# EAGLE board Environment2 (EAGLE 7.5.0)
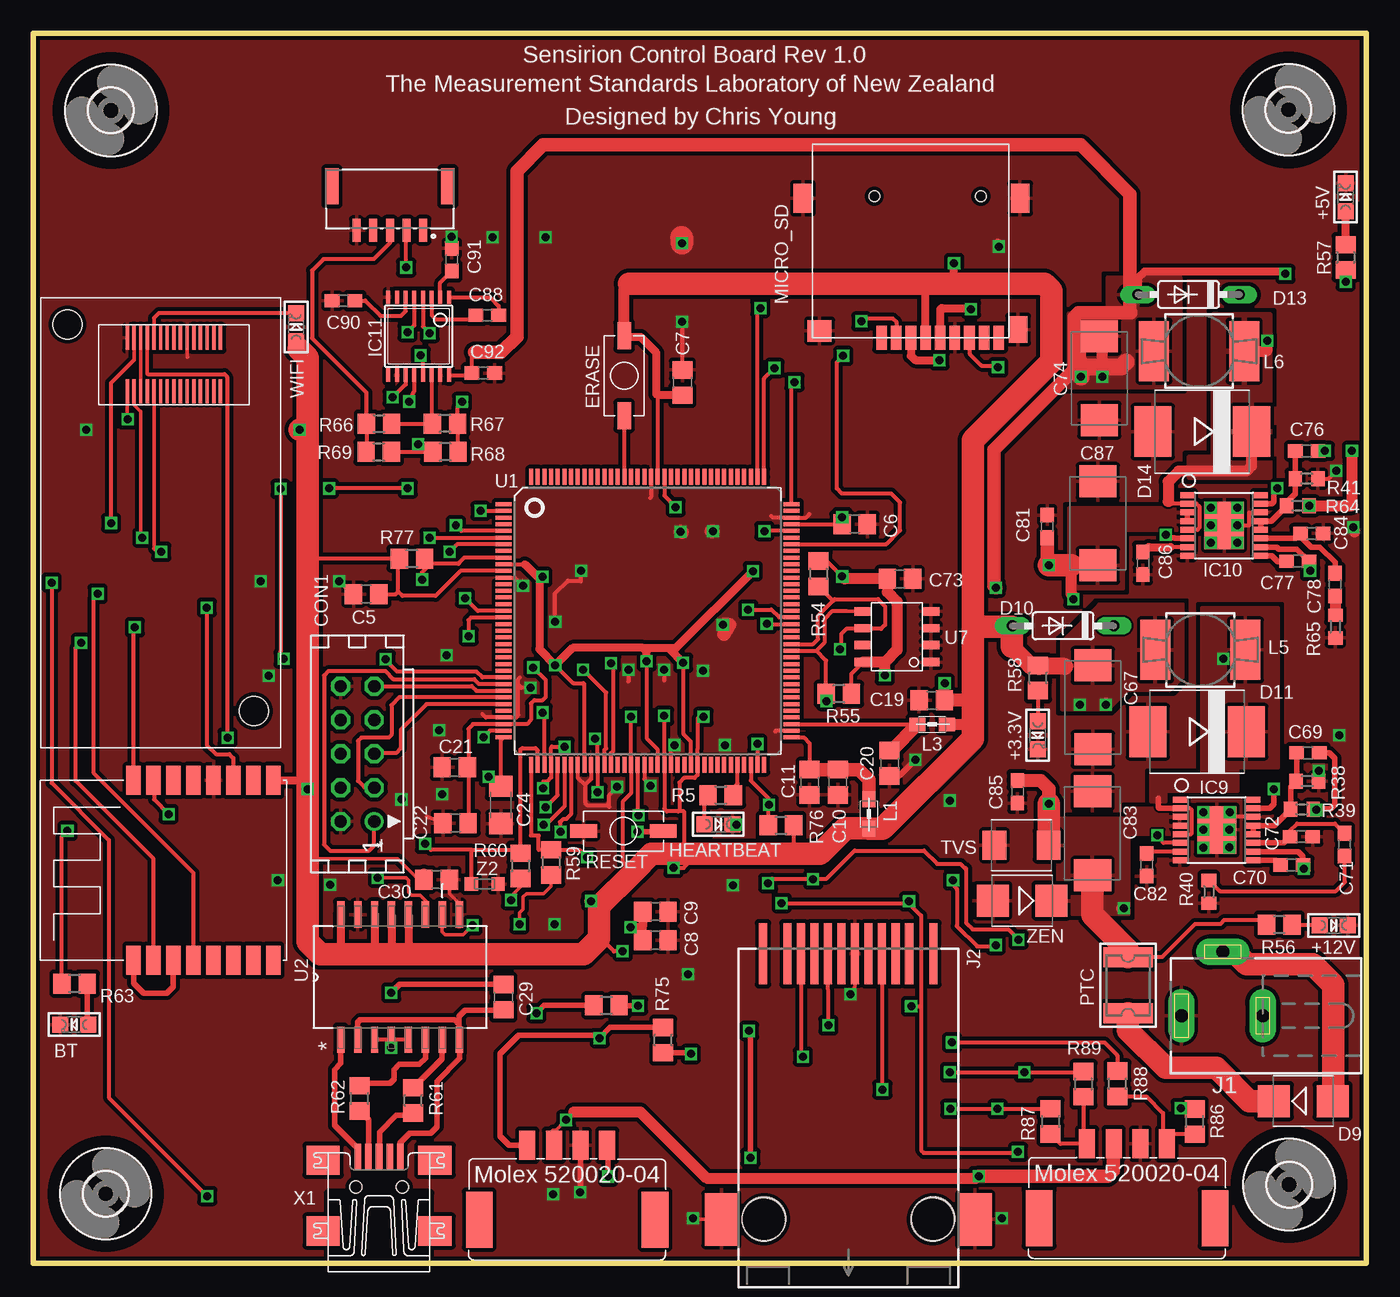
[diagram p8: board, top side]
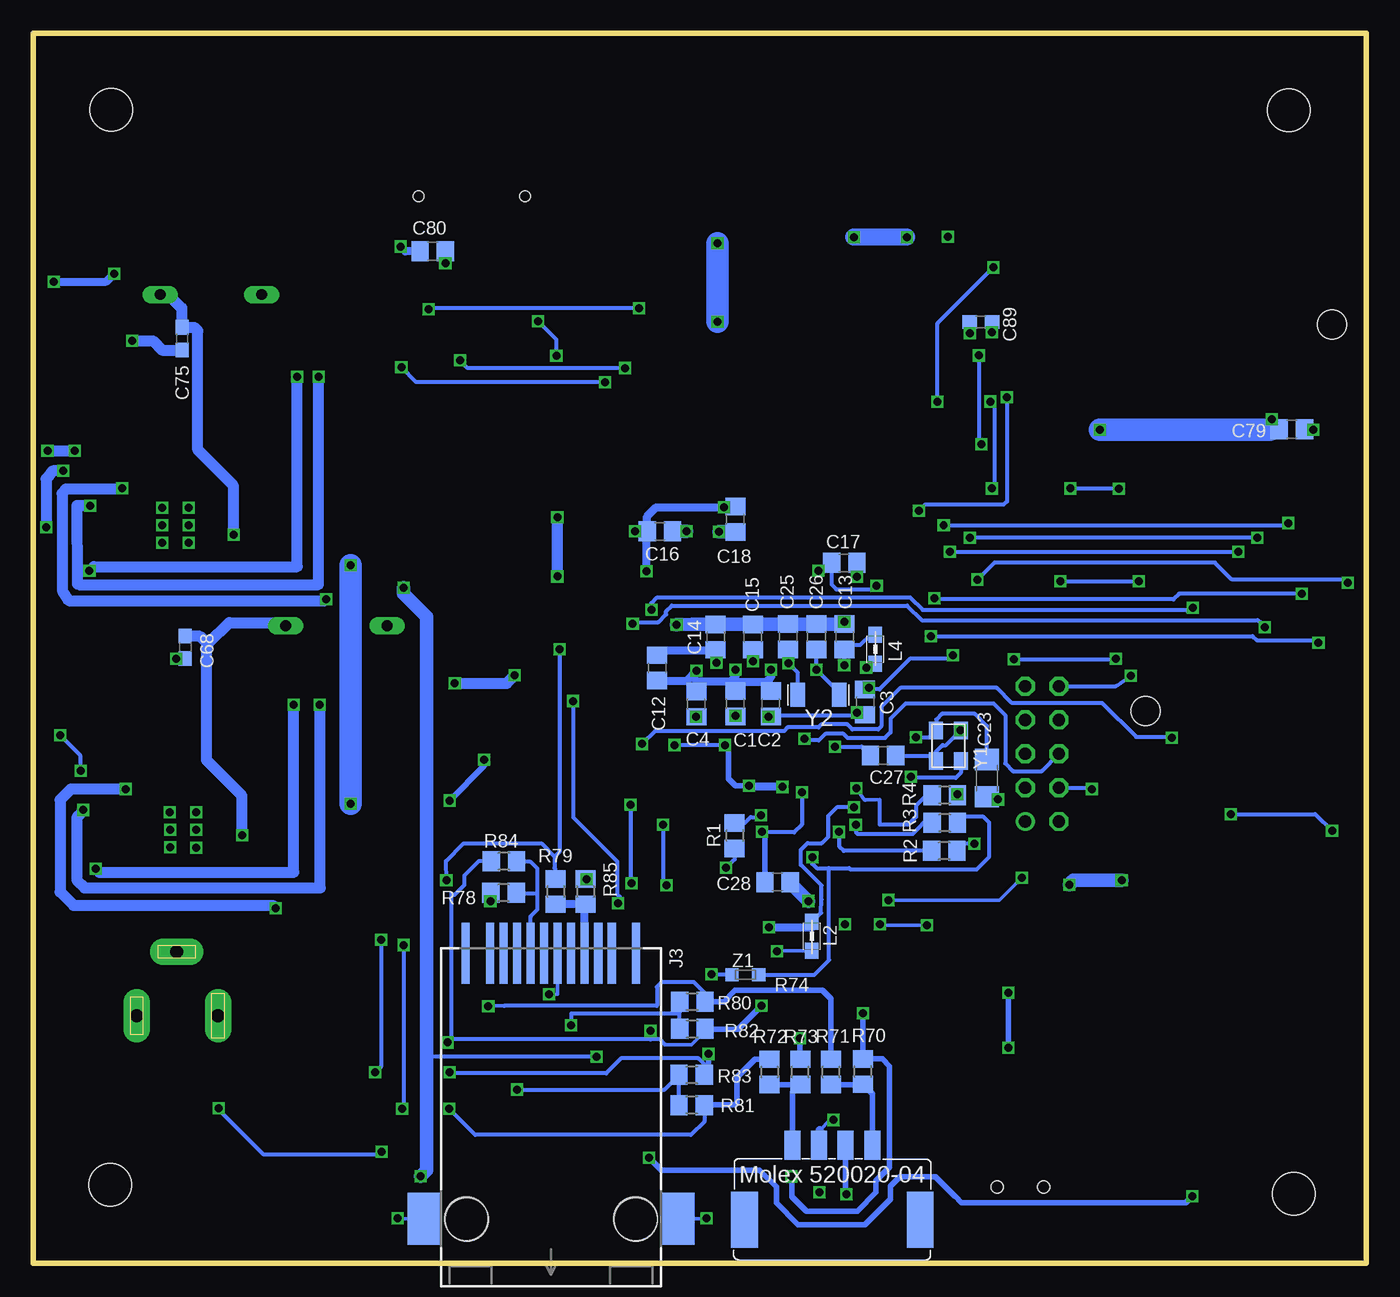
[diagram p9: board, bottom side, seen from below]

Size 100.08 x 92.33 mm. Coordinates in mm from the lower left corner, seen from the top.
Outline: 0,0 100.08,0 100.08,92.33 0,92.33 0,0
Copper layers (1*16): Top 0.035mm / dielectric 1.5mm / Bottom 0.035mm
Design rules "default": minimum track width 6mil, minimum drill 12mil, track to track 6mil, track to pad 6mil, pad to pad 6mil, via to via 6mil, smd to smd 0mil, copper to edge 10mil, drill to drill 10mil, minimum pad ring 10mil, minimum via ring 6mil, stop-mask expansion 2mil, vias tented up to drill 100mil, thermal gap 10mil
Net classes: 0 default: drill 0.305 mm, clearance 0.152 mm; 1 USB: drill 0.406 mm, clearance 0.152 mm to class 0, clearance 0.152 mm; 2 POWER_5V: width 0.61 mm, drill 0.305 mm, clearance 0.254 mm to class 0, clearance 0.254 mm to class 1, clearance 0.152 mm; 3 usbvcc: width 0.61 mm, drill 0.508 mm, clearance 0.152 mm to class 0, clearance 0.254 mm to class 1, clearance 0.254 mm to class 2, clearance 0.254 mm

## Footprints (pad centres in the part's own frame; a part is rotated, then mirrored left to right if it is on the bottom)
CHIPLED_0805 = smd 1.2 x 1.2: A 0,-1.05; C 0,1.05
C0805 = smd 1.3 x 1.5: 1 -0.95,0; 2 0.95,0
C1206 = smd 1.6 x 1.8: 1 -1.4,0; 2 1.4,0
SMC_D = smd 2.4 x 2.8: + -3.15,0; - 3.15,0
C0603 = smd 1.1 x 1: 1 -0.85,0; 2 0.85,0
CON10 = drill 0.914: 1 -5.08,-1.27 | drill 0.914 octagon: 2 -5.08,1.27; 3 -2.54,-1.27; 4 -2.54,1.27; 5 0,-1.27; 6 0,1.27; 7 2.54,-1.27; 8 2.54,1.27; 9 5.08,-1.27; 10 5.08,1.27
SMB = smd 2.4 x 2.4: A 2.2,0; C -2.2,0
DO35-7 = drill 0.813 long: A 3.81,0; C -3.81,0
SMC = smd 2.8 x 3.8: A 3.7,0; C -3.7,0
PUCHBUTTON = smd 2 x 1: P$1 3,0; P$2 -3,0
TSSOP16EXP = smd 0.45 x 1.05: 1 -2.275,-2.768; 2 -1.625,-2.768; 3 -0.975,-2.768; 4 -0.325,-2.768; 5 0.325,-2.768; 6 0.975,-2.768; 7 1.625,-2.768; 8 2.275,-2.768; 9 2.275,2.768; 10 1.625,2.768; 11 0.975,2.768; 12 0.325,2.768; 13 -0.325,2.768; 14 -0.975,2.768; 15 -1.625,2.768; 16 -2.275,2.768 | smd 3.58 x 2.94: EXP 0,0
TSSOP16 = smd 0.305 x 0.991: 1 -2.275,-2.918; 2 -1.625,-2.918; 3 -0.975,-2.918; 4 -0.325,-2.918; 5 0.325,-2.918; 6 0.975,-2.918; 7 1.625,-2.918; 8 2.275,-2.918; 9 2.275,2.918; 10 1.625,2.918; 11 0.975,2.918; 12 0.325,2.918; 13 -0.325,2.918; 14 -0.975,2.918; 15 -1.625,2.918; 16 -2.275,2.918
DCJ0303 = drill 1 pad 2 long: 1 0,3.1; 2 4.8,0; 3 0,-3
J30 = smd 0.61 x 4.597: 1 -6.401,-19.939; 2 -4.572,-19.939; 3 -3.556,-19.939; 4 -2.54,-19.939; 5 -1.524,-19.939; 6 -0.508,-19.939; 7 0.508,-19.939; 8 1.524,-19.939; 9 2.54,-19.939; 10 3.556,-19.939; 11 4.572,-19.939; 12 6.401,-19.939 | smd 2.489 x 3.912: S1 -9.525,0; S2 9.525,0 | hole 3.251: 6.35,0; -6.35,0
0805 = smd 1.2 x 1: 1 -1.1,0; 2 1.1,0
MS85 = smd 4.5 x 2.25: 1 0,-3.383; 2 0,3.383
MICROSD_PP = smd 1.8 x 0.8: 1 0,3.85; 2 0,2.75; 3 0,1.65; 4 0,0.55; 5 0,-0.55; 6 0,-1.65; 7 0,-2.75; 8 0,-3.85; 9 0,-4.95 | smd 1.6 x 1.8: GND@1 0.5,8.5 | smd 2.2 x 1.4: GND@2 10.45,9.75; GND@4 10.45,-6.55 | smd 2 x 1.4: GND@3 0.6,-6.4 | hole 0.8: 10.6,4.4; 10.6,-3.6
PTC1812 = smd 1.5 x 3.7: P$1 -2.1,0; P$2 2.1,0
R0805 = smd 1.3 x 1.5: 1 -0.95,0; 2 0.95,0
R0603 = smd 1 x 1.1: 1 -0.85,0; 2 0.85,0
SMBJ = smd 1.78 x 2.16: A 2.04,0; C -2.03,0
LQFP144 = smd 0.3 x 1.2: 1 -8.75,-10.8; 2 -8.25,-10.8; 3 -7.75,-10.8; 4 -7.25,-10.8; 5 -6.75,-10.8; 6 -6.25,-10.8; 7 -5.75,-10.8; 8 -5.25,-10.8; 9 -4.75,-10.8; 10 -4.25,-10.8; 11 -3.75,-10.8; 12 -3.25,-10.8; 13 -2.75,-10.8; 14 -2.25,-10.8; 15 -1.75,-10.8; 16 -1.25,-10.8; 17 -0.75,-10.8; 18 -0.25,-10.8; 19 0.25,-10.8; 20 0.75,-10.8; 21 1.25,-10.8; 22 1.75,-10.8; 23 2.25,-10.8; 24 2.75,-10.8; 25 3.25,-10.8; 26 3.75,-10.8; 27 4.25,-10.8; 28 4.75,-10.8; 29 5.25,-10.8; 30 5.75,-10.8; 31 6.25,-10.8; 32 6.75,-10.8; 33 7.25,-10.8; 34 7.75,-10.8; 35 8.25,-10.8; 36 8.75,-10.8; 73 8.75,10.8; 74 8.25,10.8; 75 7.75,10.8; 76 7.25,10.8; 77 6.75,10.8; 78 6.25,10.8; 79 5.75,10.8; 80 5.25,10.8; 81 4.75,10.8; 82 4.25,10.8; 83 3.75,10.8; 84 3.25,10.8; 85 2.75,10.8; 86 2.25,10.8; 87 1.75,10.8; 88 1.25,10.8; 89 0.75,10.8; 90 0.25,10.8; 91 -0.25,10.8; 92 -0.75,10.8; 93 -1.25,10.8; 94 -1.75,10.8; 95 -2.25,10.8; 96 -2.75,10.8; 97 -3.25,10.8; 98 -3.75,10.8; 99 -4.25,10.8; 100 -4.75,10.8; 101 -5.25,10.8; 102 -5.75,10.8; 103 -6.25,10.8; 104 -6.75,10.8; 105 -7.25,10.8; 106 -7.75,10.8; 107 -8.25,10.8; 108 -8.75,10.8 | smd 1.2 x 0.3: 37 10.8,-8.75; 38 10.8,-8.25; 39 10.8,-7.75; 40 10.8,-7.25; 41 10.8,-6.75; 42 10.8,-6.25; 43 10.8,-5.75; 44 10.8,-5.25; 45 10.8,-4.75; 46 10.8,-4.25; 47 10.8,-3.75; 48 10.8,-3.25; 49 10.8,-2.75; 50 10.8,-2.25; 51 10.8,-1.75; 52 10.8,-1.25; 53 10.8,-0.75; 54 10.8,-0.25; 55 10.8,0.25; 56 10.8,0.75; 57 10.8,1.25; 58 10.8,1.75; 59 10.8,2.25; 60 10.8,2.75; 61 10.8,3.25; 62 10.8,3.75; 63 10.8,4.25; 64 10.8,4.75; 65 10.8,5.25; 66 10.8,5.75; 67 10.8,6.25; 68 10.8,6.75; 69 10.8,7.25; 70 10.8,7.75; 71 10.8,8.25; 72 10.8,8.75; 109 -10.8,8.75; 110 -10.8,8.25; 111 -10.8,7.75; 112 -10.8,7.25; 113 -10.8,6.75; 114 -10.8,6.25; 115 -10.8,5.75; 116 -10.8,5.25; 117 -10.8,4.75; 118 -10.8,4.25; 119 -10.8,3.75; 120 -10.8,3.25; 121 -10.8,2.75; 122 -10.8,2.25; 123 -10.8,1.75; 124 -10.8,1.25; 125 -10.8,0.75; 126 -10.8,0.25; 127 -10.8,-0.25; 128 -10.8,-0.75; 129 -10.8,-1.25; 130 -10.8,-1.75; 131 -10.8,-2.25; 132 -10.8,-2.75; 133 -10.8,-3.25; 134 -10.8,-3.75; 135 -10.8,-4.25; 136 -10.8,-4.75; 137 -10.8,-5.25; 138 -10.8,-5.75; 139 -10.8,-6.25; 140 -10.8,-6.75; 141 -10.8,-7.25; 142 -10.8,-7.75; 143 -10.8,-8.25; 144 -10.8,-8.75
SOIC127P1032X265-16N = smd 1.981 x 0.559: 1 -4.699,4.445; 2 -4.699,3.175; 3 -4.699,1.905; 4 -4.699,0.635; 5 -4.699,-0.635; 6 -4.699,-1.905; 7 -4.699,-3.175; 8 -4.699,-4.445; 9 4.699,-4.445; 10 4.699,-3.175; 11 4.699,-1.905; 12 4.699,-0.635; 13 4.699,0.635; 14 4.699,1.905; 15 4.699,3.175; 16 4.699,4.445
CK_CUSTOM_SOIC8 = smd 0.635 x 1.27: PIN1 -1.905,-2.54; PIN2 -0.635,-2.54; PIN3 0.635,-2.54; PIN4 1.905,-2.54; PIN5 1.905,2.54; PIN6 0.635,2.54; PIN7 -0.635,2.54; PIN8 -1.905,2.54
560020-4 = smd 1.2 x 2.2: P$1 3,3.29; P$2 1,3.29; P$3 -1,3.29; P$4 -3,3.29 | smd 2 x 4.2: P$A -6.6,-2.29; P$B 6.6,-2.29
NANOREACH = smd 1.8 x 0.25: P1 7,6.5; P2 3,6.5; P3 7,7; P4 3,7; P5 7,7.5; P6 3,7.5; P7 7,8; P8 3,8; P9 7,8.5; P10 3,8.5; P11 7,9; P12 3,9; P13 7,9.5; P14 3,9.5; P15 7,10; P16 3,10; P17 7,10.5; P18 3,10.5; P19 7,11; P20 3,11; P21 7,11.5; P22 3,11.5; P23 7,12; P24 3,12; P25 7,12.5; P26 3,12.5; P27 7,13; P28 3,13; P29 7,13.5; P30 3,13.5 | hole 2.2: 2,2; 31,16
3,2 = hole 3.2: 0,0
HM-13 = smd 2.184 x 1.067: P$1 0,11.5; P$2 0,10; P$3 0,8.5; P$4 0,7; P$5 0,5.5; P$6 0,4; P$7 0,2.5; P$8 0,1; P$9 13.5,1; P$10 13.5,2.5; P$11 13.5,4; P$12 13.5,5.5; P$13 13.5,7; P$14 13.5,8.5; P$15 13.5,10; P$16 13.5,11.5
UX60-MB-5ST = smd 2 x 0.5: 1 2.25,1.6; 2 2.25,0.8; 3 2.25,0; 4 2.25,-0.8; 5 2.25,-1.6 | smd 2.2 x 2.5: M1 -3.3,-4.2; M2 -3.3,4.2; M3 2,4.2; M4 2,-4.2 | hole 0.9: 0,-1.75; 0,1.75
CM-502386-05 = smd 0.6 x 1.7: 1 2.5,-4.55; 2 1.25,-4.55; 3 0,-4.55; 4 -1.25,-4.55; 5 -2.5,-4.55 | smd 1 x 2.7: P1 4.35,-1.25; P2 -4.35,-1.25
CRYSTAL-3.2-2.5 = smd 1.3 x 1.05: 1 -1.15,-0.925; 2 1.15,-0.925; 3 1.15,0.925; 4 -1.15,0.925
ARDUINO_WIFI_SHIELD_V018_TG_RESONATOR_EPSON_FC_145 = smd 1.1 x 1.8: P$1 -1.55,0; P$2 1.55,0
CT/CN0603 = smd 1 x 1: 1 -1,0; 2 1,0

## Placement (x,y rotation side)
+3.3V  [CHIPLED_0805]  75.41,39.65 180 top
+5V  [CHIPLED_0805]  98.53,80.04 0 top
+12V  [CHIPLED_0805]  97.64,25.37 270 top
BT  [CHIPLED_0805]  3.07,17.93 90 top
C1  10u  [C0805]  47.37,42.01 90 bottom
C2  0.1u  [C0805]  44.7,42.01 90 bottom
C3  0.1u  [C0805]  37.62,42.14 90 bottom
C4  0.1u  [C0805]  50.29,41.99 90 bottom
C5  0.1u  [C0805]  24.99,50.24 180 top
C6  0.1u  [C0805]  61.67,55.5 0 top
C7  0.1u  [C0805]  48.74,66.12 90 top
C8  0.1u  [C0805]  46.71,24.26 0 top
C9  10u  [C0805]  46.71,26.42 0 top
C10  0.1u  [C0805]  60.4,36.12 270 top
C11  10u  [C0805]  58.29,36.12 270 top
C12  10u  [C0805]  53.24,44.7 270 bottom
C13  0.1u  [C0805]  39.17,47.04 90 bottom
C14  0.1u  [C0805]  48.84,47.02 90 bottom
C15  0.1u  [C0805]  46.05,47.02 90 bottom
C16  0.1u  [C0805]  53.04,54.94 0 bottom
C17  0.1u  [C0805]  39.19,52.58 180 bottom
C18  0.1u  [C0805]  47.37,55.85 270 bottom
C19  0.1u  [C0805]  67.46,42.27 180 top
C20  0.1u  [C0805]  64.29,37.54 270 top
C21  0.1u  [C0805]  31.65,37.24 180 top
C22  10u  [C0805]  31.7,33.05 180 top
C23  22p  [C1206]  28.47,36.42 270 bottom
C24  22p  [C1206]  35.1,34.42 270 top
C25  22p  [C0805]  43.41,47.04 90 bottom
C26  22p  [C0805]  41.27,47.04 90 bottom
C27  22p  [C0805]  36.27,38.13 0 bottom
C28  0.01u  [C0805]  44.2,28.63 180 bottom
C29  0.1uF  [C0805]  35.31,19.99 270 top
C30  0.1uF  [C0805]  30.28,28.8 0 top
C67  10uF  [SMC_D]  79.55,41.73 270 top
C68  0.68uF  [C0603]  88.67,46.25 270 bottom
C69  27pF  [C0603]  95.71,38.33 180 top
C70  0.1uF  [C0603]  94.49,29.9 0 top
C71  4700pF  [C0603]  98.45,31.45 270 top
C72  470pF  [C0603]  95.2,32.03 0 top
C73  0.1u  [C0805]  65.07,51.38 0 top
C74  10uF  [SMC_D]  80.04,66.45 270 top
C75  0.68uF  [C0603]  88.9,69.42 270 bottom
C76  27pF  [C0603]  95.61,60.99 180 top
C77  0.1uF  [C0603]  94.95,52.7 0 top
C78  4700pF  [C0603]  97.74,50.95 270 top
C79  10u  [C0805]  5.59,62.61 0 bottom
C80  0.1uF  [C0805]  70.08,75.97 180 bottom
C81  0.1uF  [C0603]  76.12,55.32 90 top
C82  1uF  [C0603]  83.59,29.92 270 top
C83  10uF  [SMC_D]  79.53,32.28 90 top
C84  470pF  [C0603]  95.99,54.79 0 top
C85  0.1uF  [C0603]  73.89,35.41 270 top
C86  1uF  [C0603]  83.31,52.55 270 top
C87  10uF  [SMC_D]  79.93,55.55 90 top
C88  0.1uF  [C0603]  34.09,71.17 180 top
C89  0.1uF  [C0603]  28.93,70.66 0 bottom
C90  0.1uF  [C0603]  23.29,72.26 180 top
C91  0.1uF  [C0603]  31.42,75.34 90 top
C92  0.1uF  [C0603]  33.78,66.83 0 top
CON1  [CON10]  24.33,38.25 90 top
D9  B360B-13-F  [SMB]  95.35,12.19 0 top
D10  1N4148DO35-7  [DO35-7]  77.32,47.85 180 top
D11  MBRS340T3  [SMC]  87.38,39.9 180 top
D13  1N4148DO35-7  [DO35-7]  86.74,72.72 180 top
D14  MBRS340T3  [SMC]  87.76,62.43 180 top
ERASE  PUCHBUTTON  [PUCHBUTTON]  44.36,66.63 270 top
HEARTBEAT  [CHIPLED_0805]  51.44,32.97 270 top
IC9  LT3434  [TSSOP16EXP]  88.85,32.54 270 top
IC10  LT3434  [TSSOP16EXP]  89.41,55.4 270 top
IC11  MAX3232CUE  [TSSOP16]  28.93,69.6 180 top
J1  [DCJ0303]  89.31,18.59 90 top
J2  J3011  [J30]  61.19,3.3 180 top
J3  J3011  [J30]  61.21,3.35 180 bottom
L1  MH2029-300Y  [0805]  62.74,33.73 90 top
L2  MH2029-300Y  [0805]  41.63,24.56 90 bottom
L3  MH2029-300Y  [0805]  67.49,40.46 180 top
L4  MH2029-300Y  [0805]  36.86,46.1 270 bottom
L5  33uH  [MS85]  87.63,46.05 90 top
L6  33uH  [MS85]  87.53,68.48 90 top
MICRO_SD  MICRO_SD  [MICROSD_PP]  67.54,69.49 90 top
PTC  [PTC1812]  82.19,20.88 270 top
R1  100k  [R0805]  47.42,32.11 270 bottom
R2  39R 1%  [R0805]  31.67,30.96 180 bottom
R3  39R 1%  [R0805]  31.65,33.07 180 bottom
R4  6k8 1%  [R0805]  31.65,35.15 180 bottom
R5  402R  [R0805]  51.61,35.15 0 top
R38  100K  [R0603]  95.66,36.2 180 top
R39  300K  [R0603]  95.25,34.09 180 top
R40  10K  [R0603]  88.27,27.89 90 top
R41  100K  [R0603]  95.61,58.9 180 top
R54  4.7k  [R0805]  58.95,51.76 270 top
R55  4.7k  [R0805]  60.48,42.75 180 top
R56  3k3  [R0805]  93.55,25.43 180 top
R57  1k  [R0805]  98.53,75.51 270 top
R58  402R  [R0805]  75.44,43.94 90 top
R59  24R  [R0805]  38.89,30.1 270 top
R60  24R  [R0805]  36.58,29.84 270 top
R61  24R  [R0805]  28.52,12.24 90 top
R62  24R  [R0805]  24.49,12.4 90 top
R63  402R  [R0805]  3.1,21.01 180 top
R64  165K  [R0603]  94.95,56.87 180 top
R65  10K  [R0603]  97.76,47.8 90 top
R66  0R  [R0805]  25.96,63.04 0 top
R67  DNF  [R0805]  30.91,63.04 180 top
R68  0R  [R0805]  30.94,60.91 180 top
R69  DNF  [R0805]  25.93,60.91 0 top
R70  DNF  [R0805]  37.8,14.4 90 bottom
R71  0R  [R0805]  40.18,14.38 90 bottom
R72  0R  [R0805]  44.81,14.38 270 bottom
R73  DNF  [R0805]  42.49,14.38 90 bottom
R74  DNF  [R0805]  43.03,19.38 0 top
R75  DNF  [R0805]  47.29,16.76 90 top
R76  DNF  [R0805]  56.13,32.89 0 top
R77  DNF  [R0805]  28.42,52.91 180 top
R78  0R  [R0805]  64.77,27.81 180 bottom
R79  0R  [R0805]  60.86,27.91 270 bottom
R80  0R  [R0805]  50.6,19.66 0 bottom
R81  0R  [R0805]  50.65,11.89 180 bottom
R82  DNF  [R0805]  50.6,17.6 0 bottom
R83  DNF  [R0805]  50.65,14.15 180 bottom
R84  DNF  [R0805]  64.74,30.18 180 bottom
R85  DNF  [R0805]  58.62,27.91 270 bottom
R86  0R  [R0805]  87.2,10.64 90 top
R87  0R  [R0805]  76.38,10.67 270 top
R88  DNF  [R0805]  81.41,13.49 90 top
R89  DNF  [R0805]  78.84,13.46 270 top
RESET  PUCHBUTTON  [PUCHBUTTON]  44.31,32.45 180 top
TVS  SMBJ15A-TR  [SMBJ]  74.19,31.39 180 top
U1  ATSAM3X8EA-AU  [LQFP144]  46.13,48.23 270 top
U2  ADUM4160BRWZ  [SOIC127P1032X265-16N]  27.53,21.49 90 top
U7  CK_CUSTOM_M24M02-DRMN6TP  [CK_CUSTOM_SOIC8]  64.85,47.04 90 top
U8  560020-04  [560020-4]  82.12,5.69 0 top
U9  560020-04  [560020-4]  40.08,5.59 0 top
U10  560020-04  [560020-4]  40.08,5.59 0 bottom
U$1  NANOREACH  [NANOREACH]  0.56,72.47 270 top
U$2  [3,2]  94.28,5.92 0 top
U$3  HM-13  [HM-13]  19.02,22.76 90 top
U$4  [3,2]  5.82,86.54 0 top
U$5  [3,2]  94.23,86.59 0 top
U$6  [3,2]  5.44,5.23 0 top
WIFI  [CHIPLED_0805]  19.74,70.28 0 top
X1  MINI-USB-UX60-MB-5ST  [UX60-MB-5ST]  25.96,5.74 90 top
X2  [CM-502386-05]  26.77,82.09 0 top
Y1  12MHz KX-7 20pF  [CRYSTAL-3.2-2.5]  31.37,38.86 90 bottom
Y2  32.768Khz  [ARDUINO_WIFI_SHIELD_V018_TG_RESONATOR_EPSON_FC_145]  41.12,42.67 0 bottom
Z1  CG0603MLC-05E  [CT/CN0603]  46.62,21.67 180 bottom
Z2  CG0603MLC-05E  [CT/CN0603]  33.89,28.47 0 top
ZEN  1SMB5929BT3G  [SMB]  74.24,27.23 180 top

## Tracks (layer width: path | path; a pad name or v marks a point on that pad's centre or on a via)
+3V3  (via drill 0.6)
  Top 0.254: C30.1 28.93,28.8 27.36,30.38 20.75,30.38 20.6,30.23 | v7.09,63.35 7.06,63.35 U$1.P1
  Top 0.305: 20.6,52.58 20.93,52.91 R77.2 27.41,52.84 27.41,50.42 | 55.74,30.88 55.88,30.73 | v48.06,29.69 48.82,29.69 49.15,30.02 49.15,30.73 48.84,31.04 48.84,33.93 48.44,33.93 | v44.88,41.05 44.88,39.83 U1.52 44.88,35.27 44.25,34.65 44.25,30.15 45.05,29.35 | 47.38,40.16 v47.37,41.1 U1.57 47.38,34.13 47.57,33.93 48.44,33.93 | v50.32,41.02 49.89,40.92 49.88,38.64 U1.62 49.88,36.67 49.66,36.45 48.87,36.45 48.51,36.09 48.51,34.01 48.44,33.93 | 49.88,30.8 49.81,30.73 | v44.25,23.42 43.59,23.42 42.49,24.51 | 46.87,65.17 46.88,65.16 U1.125 | U1.105 60.71,55.48 C6.1 | R76.2 57.08,31.13 57.48,30.73 | R55.1 61.43,44.26 U7.PIN8 | R54.1 59.58,52.71 v60.73,51.56 | U1.11 32.07,51.98 30.2,50.11 27.71,50.11 27.41,50.42 | C5.1 27.23,50.24 27.41,50.42 | U1.39 38.38,41.23 v38.25,41.35 | 95,30.91 95.35,30.56 95.35,29.69 v95.4,29.64
  Top 0.406: WIFI.A 19.74,68.86 19.94,68.66 | IC9.10 94.79,30.91 | 94.79,30.91 | 94.79,30.91 95,30.91 95.33,30.58 95.33,29.91 C70.2 | R39.1 96.29,34.09 v96.34,34.04 96.42,34.11 97.41,34.11 97.71,34.42 97.71,37.92 97.31,38.33 C69.1 | 77.5,44.88 77.42,44.81
  Top 0.61: 69.12,73.52 69.12,75.07 v69.14,75.08 | MICRO_SD.4 66.99,73.47 66.93,73.53 | C7.1 46.87,65.17 46.79,65.25 46.79,68.35 45.62,69.52 44.47,69.52 ERASE.P$2 | U$3.P$9 20.54,36.26 20.6,36.2 | 68.56,40.43 L3.1 | U2.16 23.09,23.29 23.19,23.19 | U2.14 25.63,23.24 25.58,23.19 | U2.13 26.9,23.32 26.77,23.19 | U2.12 28.17,23.22 28.14,23.19
  Top 0.813: 29.31,29.25 C30.1 | 69.12,73.52 69.11,73.53 | ERASE.P$2 44.36,73.17 44.73,73.53 | L3.1 70.36,40.46 70.54,40.28 | 63.93,45.14 64.85,46.05 64.85,49.68 64.12,50.4 C73.1 60.91,51.38 v60.73,51.56 | 63.93,45.14 U7.PIN8 | v60.73,56.01 60.73,55.51 C6.1 | C19.1 68.41,43.52 v68.43,43.54 | v63.93,44.15 63.93,45.14 | v80.52,41.94 80.52,42.04 80.54,42.06 | v78.56,41.94 78.56,41.91 | R58.2 74.84,44.89 | D10.A 73.46,47.8
  Top 1.016: v41.88,27.2 42.09,27.2 42.49,26.8 | C19.1 70.56,42.32 70.54,42.52
  Top 1.27: 74.84,44.89 73.46,46.28 | 77.42,44.81 75.52,44.81 R58.2
  Top 1.676: 20.6,62.56 20.6,52.58 20.6,36.2 v20.6,35.61 20.6,30.23 20.6,24.13 21.54,23.19 23.19,23.19 25.58,23.19 26.77,23.19 28.14,23.19 41.33,23.19 42.49,24.36 42.49,24.51 42.49,26.8 45.05,29.35 46.43,30.73 49.15,30.73 49.81,30.73 55.88,30.73 57.48,30.73 59.05,30.73 60.98,32.66 62.7,32.66 L1.1 63.77,32.63 70.54,39.4 70.54,40.28 70.54,42.52 70.54,47.88 | 20.6,62.56 20.6,68 19.94,68.66 | v19.99,62.56 20.6,62.56 | 44.73,73.53 66.93,73.53 69.11,73.53 75.92,73.53 76.43,73.03 76.43,67.67 70.54,61.77 70.54,47.88 | 70.54,47.88 70.61,47.8 73.46,47.8 73.46,46.28
  Bottom 0.305: v7.09,63.35 7.09,62.71 7.24,62.56 | R1.2 47.42,30.33 v48.06,29.69 | v44.88,41.05 44.69,41.05 C2.1 44.64,41.12 38.4,41.12 | v47.37,41.1 47.39,41.05 C1.1 | v38.25,41.35 38.4,41.12 | 38.4,41.12 C3.1 | v50.32,41.02 50.28,41.01 C4.1 | L2.1 44.23,23.44 v44.25,23.42 | CON1.4 20.7,35.71 v20.6,35.61
  Bottom 0.406: C79.1 6.54,62.8 v7.09,63.35
  Bottom 0.61: v69.14,75.08 C80.1
  Bottom 0.813: v60.73,51.56 v60.73,56.01 | v68.43,43.54 64.54,43.54 v63.93,44.15 | v95.4,29.64 95.38,29.64 95.1,29.36 80.54,29.36 80.52,29.39 v80.52,41.94 | v96.34,34.04 96.34,33.96 96.52,33.78 96.52,33.76 96.8,33.48 96.8,28.78 96.22,28.19 78.54,28.19 78.54,41.76 v78.56,41.94
  Bottom 1.016: C28.1 43.25,28.57 v41.88,27.2
  Bottom 1.676: 7.24,62.56 v19.99,62.56
  pour Top: 86.31,44.02 86.31,49.45 80.04,49.45 77.22,46.63 77.22,41.61 80.72,41.61 82.19,43.08 85.37,43.08
+5V  (via drill 0.6)
  Top 0.254: 39.08,9.85 v40.01,10.77
  Top 0.305: IC11.16 32.78,66.68 C92.1 32.93,68.16 33.15,68.38 | J2.10 57.63,15.67 v57.78,15.52 | v40.01,10.77 40.01,10.82 40.56,11.38
  Top 0.406: IC10.10 93.37,53.77 93.52,53.62 94.88,53.62 | 94.88,53.62 C77.2 | 94.88,53.62 94.88,53.61 95.86,52.63 v95.86,51.99
  Top 0.61: R57.2 v98.53,73.69 | v94,74.27 93.9,74.27 93.73,74.45 83.44,74.45 82.93,73.94 D13.A | U9.P$3 39.08,9.85
  Top 0.813: v80.26,66.55 80.26,69.37 C74.+ | v95.81,56.87 R64.1 99.03,56.87 | v78.66,66.55 78.66,69.42 78.84,69.6 C74.+ | C74.+ | 99.06,56.9 99.03,56.87 | 99.03,56.87 99.03,61.01 v99.01,60.98 | v96.98,60.98 C76.1 | 40.56,11.38 45.57,11.38 50.55,6.4 70.84,6.4 v70.99,6.55
  Top 1.016: 33.15,68.38 35.13,68.38 36.32,69.57 36.32,81.99 38.28,83.95 78.64,83.95 82.35,80.24 82.35,73.3 | 82.35,73.3 D13.A | 82.35,73.3 82.35,71.42 82.42,71.35 78.46,71.35 78.18,71.07 78.18,67.13 72.14,61.09 72.14,50.85 v72.26,50.72 | v70.99,6.55 80.67,6.55 81.08,6.96 81.08,8.94 U8.P$3
  Top 1.27: v78.66,66.55 78.66,67.51 78.31,67.87 78.31,67.54 78.56,67.28 81.66,67.28 82.04,67.67
  Bottom 0.254: v40.01,10.77 40.26,10.77 41.02,10.01
  Bottom 0.305: v57.78,15.52 70.26,15.52 70.54,15.24
  Bottom 0.61: v98.53,73.69 94.59,73.69 v94,74.27 | 41.02,10.01 41.02,8.94 U10.P$3
  Bottom 0.813: v95.86,51.99 95.81,51.99 95.5,52.3 80.26,52.3 v80.26,66.55 | v95.81,56.87 96.8,56.87 96.77,51 96.65,50.95 78.66,50.95 v78.66,66.55 | v99.01,60.98 v96.98,60.98
  Bottom 1.016: v72.26,50.72 72.26,50.27 70.54,48.54 70.54,15.24 70.54,7.01 v70.99,6.55
  pour Top: 77.72,65.71 86.16,65.71 86.16,74.02 80.64,74.02 80.64,71.32 77.72,71.32
+12V  (via drill 0.6)
  Top 0.305: PTC.P$1 82.2,22.99 84.73,22.99 87.22,25.48 89.13,25.48 89.43,25.78 92.24,25.78 R56.2
  Top 0.406: IC10.15 92.99,57.02 93.14,57.17 93.14,57.94 v93.4,58.19 | IC9.15 92.84,34.16 93.14,34.47 v93.14,35.61 | IC10.3 IC10.4
  Top 0.813: v78.08,49.86 78.08,50.09 77.93,50.24 77.93,52.4 C87.+ | v81.86,26.64 81.71,26.64
  Top 1.016: C81.1 76.12,52.53 v76.25,52.4 | C85.1 75.64,36.25 76.25,35.64 v76.25,34.52
  Top 1.676: PTC.P$1 82.19,23.5 79.53,26.16 C83.+ | 77.93,52.4 v76.25,52.4 | v76.25,34.52 76.25,31.42 TVS.C
  Bottom 0.813: v93.4,58.19 93.4,58.22 93.45,58.12 97.64,58.12 97.92,57.78 97.89,50.52 97.41,49.76 78.18,49.76 v78.08,49.86 | v93.14,35.61 97.26,35.61 98.07,34.8 98.07,27.89 97.05,26.87 82.09,26.87 v81.86,26.64
  Bottom 1.676: v76.25,52.4 v76.25,34.52
  pour Top: 86.08,34.09 86.97,34.09 86.97,32.23 82.22,32.23 82.22,26.21 76.96,26.21 76.96,33.43 82.17,33.43 82.17,34.16 86.08,34.16
  pour Top: 87.22,55.47 87.22,56.67 77.75,56.67 77.75,50.67 81.84,50.67 81.84,54.66 81.84,54.94 81.84,55.02 81.84,55.07 87.33,55.07
A  (via drill 0.6)
  Top 0.406: R74.1 38.35,19.38 v37.77,18.8 | v43.16,6.53 43.16,8.8 U9.P$1
  Bottom 0.406: v37.77,18.8 37.77,15.38 R70.2 36.33,15.35 35.79,14.81 35.79,7.24 36.8,6.22 36.8,5.33 38.2,3.94 42.04,3.94 43.1,5 43.1,6.48 v43.16,6.53
AVREF
  Top 0.305: U1.75 66.36,40.48 L3.2
  Top 1.016: C20.1 64.42,38.49 L3.2
B  (via drill 0.6)
  Top 0.406: U9.P$4 37.07,8.87 35.71,8.87 35.04,9.54 35.04,15.73 36.45,17.14 42.29,17.14 v42.52,16.92 43.32,17.71 R75.2
  Bottom 0.406: v42.52,16.92 42.52,15.35 R73.2
D10  (via drill 0.6)
  Top 0.305: U1.102 64.04,53.98 65.08,55.02 65.08,57.12 64.41,57.78 60.71,57.78 60.33,58.17 60.33,67.64 v60.81,68.12 | v62.18,70.71 62.33,70.71 62.56,70.94 64.52,70.94 64.8,70.66 64.8,69.5 MICRO_SD.2
  Bottom 0.305: v60.81,68.12 60.81,69.34 v62.18,70.71
D13
  Top 0.305: R5.2 52.56,35.7 52.88,36.02 U1.68
D18  (via drill 0.6)
  Top 0.254: U$1.P9 9.06,53.68 9.12,53.62
  Top 0.305: U1.7 31.84,53.98 v31.27,53.42 | v9.6,53.42 9.32,53.42 9.12,53.62 9.07,53.67
  Bottom 0.305: v31.27,53.42 v9.6,53.42
D42  (via drill 0.6)
  Top 0.254: 8.56,66.78 U$1.P8
  Top 0.305: 8.56,66.78 8.59,66.75 14.35,66.75 14.55,66.55 14.55,39.5 v14.58,39.47 | v54.36,38.99 54.36,37.45 U1.71
  Bottom 0.305: v54.36,38.99 53.39,39.95 43.71,39.95 43.43,40.23 41.12,40.23 40.89,40.46 38.96,40.46 38.58,40.08 36.63,40.08 36.4,40.31 36.4,41.78 34.98,43.2 27.74,43.2 26.59,42.06 19.81,42.06 17.27,39.52 14.63,39.52 v14.58,39.47
D64  (via drill 0.6)
  Top 0.305: U$3.P$16 7.53,47.66 v7.62,47.75 | v55.07,48.01 55.09,47.98 U1.90
  Bottom 0.305: 7.95,48.13 7.62,47.8 v7.62,47.75 8.15,48.28 33.38,48.28 34.47,49.38 52.12,49.38 52.55,48.95 52.55,48.72 53.14,48.13 54.94,48.13 v55.07,48.01
D65  (via drill 0.6)
  Top 0.305: U1.91 56.01,48.48 55.42,49.07 v53.67,49.07 | v13.03,49.23 13.03,38.91 13.72,38.23 14.71,38.23 15.01,37.92 15.01,36.27 U$3.P$11
  Bottom 0.305: 13.36,48.9 v13.03,49.23 | 13.18,49.07 v13.03,49.23 | v53.67,49.07 53.67,49.55 53.24,49.99 34.24,49.99 33.3,49.05 13.21,49.05 v13.03,49.23
D+  (via drill 0.6)
  Top 0.305: v41.58,30.48 41.01,31.05 R59.1 37.94,31.05 37.95,31.11 37.95,32.11 37.54,32.11 | 37.54,32.11 37.36,32.11 37.38,32.12 | U1.37 37.38,32.27 37.54,32.11
  Bottom 0.305: v41.58,30.48 41.58,30 41.25,29.67 40.36,29.67 | 40.36,29.67 38.81,29.67 38.71,29.57 29.26,29.57 28.3,30.53 28.3,33.1 28.73,33.53 30.7,33.53 R3.1 | Z1.1 41.43,21.67 40.34,22.76 40.34,29.64 40.36,29.67
D-  (via drill 0.6)
  Top 0.305: 32.94,31.05 29.86,31.05 v29.41,31.5 | Z2.1 32.89,31 32.94,31.05 | 32.94,31.05 36.32,31.05 R60.1 36.58,38.56 36.7,38.68 37.69,38.68 37.88,38.5 U1.38
  Bottom 0.305: v29.41,31.5 30.7,31.5 R2.1
ERASE_S
  Top 0.305: U1.130 44.38,63.62 ERASE.P$1
IGND  (via drill 0.6)
  Top 0.254: U2.9 31.98,26.26 31.85,26.39 31.85,27.15 31.24,27.76 31.24,28.79 C30.2 | J2.6 61.7,20.8 v61.34,20.19 | v72.72,3.38 72.9,3.38 72.92,3.4 | J2.S2 49.61,3.3 v49.53,3.38 | 11.56,68.05 U$1.P20
  Top 0.305: IC10.EXP v90.4,55.4 91.24,55.4 91.26,55.42 91.26,55.4 91.29,55.37 91.29,56.36 92.17,56.36 IC10.14 | v17.68,44.09 17.65,44.35 17.63,44.37 | v47.37,44.55 47.37,43.74 | v44.7,44.55 44.68,43.66 | v50.27,44.5 50.27,44.53 | C22.2 29.54,33.53 | v31.04,45.64 30.96,45.64 30.94,45.67 | 36.73,51.16 36.73,51.21 36.75,51.18 v36.75,50.88 36.15,51.48 U1.12 | v39.19,48.16 39.19,50.31 40.14,51.26 41.05,51.26 41.12,51.18 v41.12,51.99 | v30.45,40.01 30.43,39.98 | C91.2 v31.42,77.06 | HEARTBEAT.C 52.48,32.94 52.65,32.77 52.65,32.79 v52.81,32.94 | v52.53,28.4 52.38,28.4 | v49.15,21.69 49.3,21.69 | U1.58 47.88,38.63 v48.16,38.91 | v51.92,38.91 52.05,38.91 | U1.54 45.88,36.34 v46.35,35.87 | U1.46 41.88,36.37 41.43,35.92 | 41.43,35.92 41.43,34.54 41.58,34.39 43.1,34.39 43.23,34.27 43.23,35.15 v43.84,35.76 | v27.64,34.82 27.51,34.82 | C7.2 48.74,70.66 v48.72,70.69 | R38.1 96.51,36.97 v96.52,36.98 | v98.07,39.65 98.27,39.65 | U1.44 40.88,36.47 41.43,35.92 | U1.126 46.38,57.5 46.33,57.45 | U1.74 55.76,39.98 55.7,39.93 55.73,39.93 55.75,39.95 | 39.12,25.5 v39.14,25.48 | 33.73,41.22 33.97,40.98 U1.33 36.26,40.98 36.32,41.05 36.32,41.07 36.35,41.1 36.35,41.12 36.4,41.17 36.4,43.46 | 36.4,43.46 36.4,43.84 36.52,43.97 | v37.34,43.2 36.65,43.2 36.4,43.46 | 55.4,56.11 55.52,55.98 U1.106 58.02,55.98 58.27,56.24 | IC9.14 89.82,33.51 IC9.EXP | C5.2 23.93,50.24 v22.96,51.21 | v17.07,51.21 16.89,51.21 16.87,51.23 | 11.56,68.05 11.58,68.02 | R41.1 97.26,58.9 v97.84,59.49
  Top 0.406: v39.04,5.21 39.04,5.05 39.01,5.03 | U9.P$2 41.08,5.39 v41.05,5.36 | C20.2 65.01,36.59 v66.22,37.8 | v68.83,34.75 68.83,34.59 | v87.86,33.86 v87.86,32.54 | v87.86,32.54 v87.86,31.22 | v87.86,32.54 89.81,32.54 v89.81,31.24 | v89.84,33.86 89.82,33.86 89.82,33.51 | v88.42,54.08 v88.42,55.4 v88.42,56.72 | v90.4,54.08 v90.4,55.4 v90.4,56.72
  Top 0.61: v72.49,76.33 72.49,76.56 72.42,76.63
  Top 0.813: v3.99,62.59 3.91,62.59 | v99.11,55.27 99.21,54.89
  Top 1.016: v51.77,47.95 52.27,47.95 51.84,47.22 | v48.59,54.91 48.64,54.91 48.69,54.86 | v51.03,54.94 50.93,54.94
  Top 1.676: v48.72,76.58 48.72,76.96 48.67,77.01
  Bottom 0.254: v61.34,20.19 60.71,20.19 J3.6 | J3.S2 72.69,3.35 v72.72,3.38 | 49.3,3.4 49.33,3.38 v49.53,3.38 49.55,3.35 J3.S1 | 34.52,77.04 v34.49,77.01
  Bottom 0.305: R4.1 30.7,35.16 v30.71,35.23 | CON1.10 18.8,43.33 v17.68,44.09 | C2.2 v44.7,44.55 | C1.2 47.37,43.54 v47.37,44.55 | C4.2 50.29,43.66 50.29,44.48 v50.27,44.5 | C3.2 37.22,43.09 | v31.04,45.64 31.27,45.41 34.21,45.41 36.54,43.09 37.22,43.09 | v36.75,50.88 37.03,50.6 39.78,50.6 40.14,50.96 C17.2 40.73,51.99 v41.12,51.99 | C13.2 39.17,48.13 v39.19,48.16 | v30.45,40.01 30.49,40.06 Y1.2 31.54,38.91 31.8,38.91 31.85,38.86 31.85,38.84 31.88,38.84 32.29,38.42 Y1.4 32.71,38.12 C27.2 | v52.81,32.94 52.81,28.68 v52.53,28.4 | Z1.2 49.12,21.67 v49.15,21.69 | v48.16,38.91 v51.92,38.91 | C23.2 27.84,35.02 v27.64,34.82 | v96.52,36.98 96.52,38.1 v98.07,39.65 | 37.22,43.09 v37.34,43.2 | v22.96,51.21 v17.07,51.21
  Bottom 0.406: v46.35,35.87 47.35,35.87 47.88,36.4 47.88,38.63 v48.16,38.91 | U10.P$2 39.08,5.25 v39.04,5.21 | v41.05,5.36 41.05,5.31 | v66.22,37.8 66.22,37.36 v68.83,34.75
  Bottom 0.61: C80.2 72.14,75.97 v72.49,76.33 | C12.2 51.01,43.75 v50.27,44.5 | v47.37,44.55 47.37,44.02 47.73,43.66 50.29,43.66 | v44.7,44.55 44.7,43.97 45.06,43.61 47.3,43.61 47.37,43.54 | v43.84,35.76 46.25,35.76 v46.35,35.87
  Bottom 0.813: C79.2 4.01,62.61 v3.99,62.59 | v97.84,59.49 98.63,59.49 99.11,58.88 v99.11,55.27
  Bottom 1.016: C13.2 C26.2 C25.2 46.02,47.99 C15.2 | C15.2 C14.2 | C15.2 50.59,47.97 v51.77,47.95 | C18.2 v48.58,54.91 v48.59,54.91 | C16.2 v51.03,54.94 | v18.36,28.75 21.97,28.75 v22.3,28.42
  Bottom 1.27: 34.52,77.04 v38.46,77.04 38.48,77.04
  Bottom 1.676: v48.72,70.69 v48.72,76.58
  other vias: 89.81,32.56
  pour Top (isolate 0.305, rank 2): 38.71,0.36 30.1,0.38 0.43,0.38 0.56,72.67 0.56,91.72 0.71,91.87 99.64,91.87 99.64,0.43 99.69,0.38 38.63,0.38
MASTER-RESET  (via drill 0.6)
  Top 0.305: v42.37,35.36 42.38,35.98 U1.47 42.38,39.18 v42.19,39.37
  Top 0.406: v45.36,32.41 47.27,32.41 RESET.P$2
  Bottom 0.305: CON1.6 24.36,36.96 26.52,36.96 27.1,37.54 27.1,41.15 27.96,42.01 34.59,42.01 35.23,41.38 35.37,41.24 35.71,40.89 35.71,39.85 36.12,39.45 36.17,39.45 36.2,39.42 38.91,39.42 39.24,39.75 40.62,39.75 41.1,39.27 42.09,39.27 v42.19,39.37 | v42.37,35.36 42.37,32.94 42.95,32.36 45.31,32.36 v45.36,32.41
  Bottom 0.406: C28.2 45.15,32.19 v45.36,32.41
MISO  (via drill 0.6)
  Top 0.305: U1.108 56.93,65.92 v57.15,66.14 | MICRO_SD.7 70.29,68.29 71.2,67.39 72.31,67.39 v72.44,67.26
  Bottom 0.305: v57.15,66.14 71.32,66.14 v72.44,67.26
MOSI  (via drill 0.6)
  Top 0.305: U1.109 54.88,66.43 v55.65,67.21
  Top 0.61: MICRO_SD.3 65.89,68.12 66.22,67.79 v68.05,67.79
  Bottom 0.305: v55.65,67.21 67.46,67.21 v68.05,67.79
N$2
  Top 0.305: R58.1 75.44,40.73 +3.3V.A
N$3
  Top 1.676: D9.C 91.31,12.19 88.82,14.68 85.01,14.68 82.19,17.5 PTC.P$2
N$4
  Top 0.61: R57.1 +5V.A
N$5  (via drill 0.6)
  Top 0.305: U2.5 U2.4 U2.3
  Top 0.406: C29.1 27.49,20.94 v26.87,20.32 | v26.87,16.2 26.87,16.76 U2.4
  Bottom 0.406: v26.87,20.32 v26.87,16.2
N$6
  Top 0.305: HEARTBEAT.A 50.38,34.88 R5.1
N$7
  Top 0.406: U$3.P$1 7.53,21.05 8.28,20.3 10.01,20.3 10.49,20.78 10.49,22.72 U$3.P$3
N$10
  Top 0.406: R62.2 24.49,13.51 26.8,13.51 27.1,13.82 27.1,14.55 27.48,14.94 28.98,14.94 29.44,15.39 U2.6
N$11
  Top 0.406: U2.7 30.71,15.38 R61.2
N$24
  Top 0.305: C72.1 94.35,32.48 94.89,33.02 97.73,33.02 C71.1
  Top 0.406: IC9.11 93.88,31.56 C72.1
N$26
  Top 0.406: IC9.9 93.27,30.26 C70.1
N$27  (via drill 0.6)
  Top 0.305: IC9.6 84.85,31.56 v84.4,32.13
  Bottom 0.406: 88.63,47.14 C68.1
  Bottom 0.813: v84.4,32.13 84.4,35.1 87.07,37.77 87.07,46.58 | 87.07,46.58 87.55,47.07 88.63,47.07 C68.1 | 87.07,46.58 86.89,46.58 85.37,48.11 81.38,48.11 D10.C
N$28
  Top 0.305: R40.2 89.09,27.95 97.8,27.95 98.48,28.63 98.48,30.57 C71.2
N$29  (via drill 0.6)
  Top 0.305: IC9.5 86.9,32.21 86.97,32.28 86.97,34.04 86.84,34.16 IC9.2 | v89.33,45.39 90.35,45.39 L5.1
  Top 0.406: IC9.2 84.56,34.16 84.48,34.24 84.48,34.9
  Bottom 0.305: C68.2 89.32,45.4 v89.33,45.39
  pour Top: 87.73,40.77 87.73,49.23 93.47,49.23 93.47,37.21 90.42,37.21 90.42,35.46 85.04,35.46 85.04,34.65 83.9,34.65 83.9,36.7 87.73,36.7
N$30
  Top 0.305: IC9.7 83.73,30.91 C82.1
N$42  (via drill 0.6)
  Top 0.254: R59.2 38.89,28.32 38.33,27.76 37.03,27.76 36.78,27.51 36.78,26.59 36.5,26.31 v36.5,25.48 | v32.97,25.38 32.28,24.69 30.91,24.69 30.71,24.89 U2.10
  Bottom 0.254: v32.97,25.38 36.4,25.38 v36.5,25.48
N$44
  Top 0.305: R56.1 96.61,25.43 +12V.A
N$45  (via drill 0.6)
  Top 0.254: R60.2 36.58,28.27 35.94,27.64 35.94,27.36 v35.87,27.28 | v25.86,28.96 27.99,28.96 28.17,28.78 28.17,27.86 28.4,27.64 29.06,27.64 29.49,27.2 29.49,26.24 U2.11
  Bottom 0.254: v35.87,27.28 27.53,27.28 v25.86,28.96
N$46
  Top 0.406: R63.1 4.05,18.01 BT.A
N$47  (via drill 0.6)
  Top 0.305: 9.07,36.22 9.07,34.82 v10.16,33.73 | v2.56,32.46 2.54,32.46 2.15,32.07 R63.2
  Top 0.406: 9.07,36.22 U$3.P$15
  Bottom 0.305: v10.16,33.73 3.83,33.73 v2.56,32.46
N$52
  Top 0.254: U$1.P6 U$1.P5
N$53  (via drill 0.6)
  Top 0.305: v39.57,32.38 39.55,32.41 39.55,33.12 39.78,33.35 40.01,33.35 40.36,33.71 40.36,37.42 U1.43
  Bottom 0.305: R2.2 39.22,30.96 39.57,31.32 v39.57,32.38
N$56  (via drill 0.6)
  Top 0.305: U1.42 39.88,34.31 38.79,33.22 38.61,33.22 v38.33,32.94
  Bottom 0.305: R3.2 32.74,33.55 34.06,32.23 38.18,32.23 38.28,32.33 38.28,32.89 v38.33,32.94
N$59  (via drill 0.6)
  Top 0.305: 45.36,33.78 45.44,33.71 v45.44,33.66 45.38,33.72 U1.53
  Bottom 0.305: R1.1 46.67,33.06 46.23,33.5 45.59,33.5 v45.44,33.66
N$62
  Top 0.406: IC9.12 IC9.13 93.18,32.86 R39.2 94.4,35.79 R38.2 94.86,36.25 C69.2
N$63  (via drill 0.6)
  Top 0.406: IC10.6 85.71,54.42 85.65,54.48 85.24,54.48 v85.04,54.69
  Bottom 0.813: v85.04,54.69 85.04,58.37 87.73,61.06 87.73,70 87.96,70.23 88.86,70.23 C75.1 88.92,70.29 88.92,71.7 89.94,72.72 D13.C
N$64
  Top 0.406: IC10.9 93,53.12 93.45,52.68 94.07,52.68 C77.1
N$69  (via drill 0.6)
  Top 0.305: IC10.5 87.4,55.07 87.53,55.19 87.53,56.82 87.33,57.02 IC10.2 85.39,57.02 85.24,57.17
  Top 0.813: D14.C 91.46,59.86 91.06,59.46 86,59.46 85.22,58.67 85.22,57.2 85.24,57.17 | L6.1 92.58,68.48 92.63,68.53 v92.63,69.24
  Bottom 0.813: v92.63,69.24 91.08,69.24 90.4,68.56 88.91,68.56 C75.2
  pour Top: 92.84,71.2 88.6,71.2 88.6,60.53 86.79,60.53 86.79,59 92.84,59
N$70
  Top 0.305: IC10.7 85.39,53.77 | 85.39,53.77
  Top 0.61: C86.1 83.38,53.4 83.74,53.77 85.39,53.77
N$72
  Top 0.406: C78.1 97.74,52.63 96.6,53.77 95.94,53.77 95.14,54.57 C84.1 94.77,54.42 IC10.11
N$74
  Top 0.813: C78.2 97.74,48.68 R65.2
N$80
  Top 0.305: IC11.1 34.29,72.51 34.95,71.86 34.95,71.18 C88.1
N$81
  Top 0.305: IC11.3 29.91,71.16 30.2,70.87 32.93,70.87 C88.2
N$82  (via drill 0.6)
  Top 0.305: IC11.4 29.26,70.34 v29.77,69.83
  Bottom 0.305: v29.77,69.83 29.77,70.65 C89.1
N$83
  Top 0.305: R69.1 25.01,60.94 R66.1 24.99,63.06 24.99,65.38 20.93,69.44 20.93,74.52 21.79,75.39 25.55,75.39 26.77,76.61 X2.3
N$84  (via drill 0.6)
  Top 0.305: R68.1 31.86,60.94 R67.1 31.86,64.35 v32.18,64.67 | v27.99,74.75 27.99,77.51 X2.2
  Bottom 0.305: v32.18,64.67 32.18,70.56 v27.99,74.75
N$85
  Bottom 0.406: U10.P$1 37.08,12.74 R70.1 37.82,13.43 R71.1
N$87
  Bottom 0.406: U10.P$4 43.08,12.84 R73.1 R72.2
N$89  (via drill 0.6)
  Top 0.305: v59.69,17.88 J2.8
  Bottom 0.305: v59.69,17.88 59.69,18.77 51.65,18.77 51.55,18.87 | R82.1 51.55,18.87 | 51.55,18.87 R80.1
N$91  (via drill 0.6)
  Top 0.305: J2.4 63.73,13.54 v63.75,13.06
  Bottom 0.305: R81.2 R83.2 52.69,13.06 v63.75,13.06
N$92
  Bottom 0.305: J3.8 62.74,26.06 62.23,26.57 62.23,27.69 | 62.23,27.69 62.23,29.64 62.74,30.15 63.77,30.15 R84.1 | 62.23,27.69 62.28,27.74 63.74,27.74 R78.1
N$98
  Bottom 0.61: J3.4 58.67,26.91 R85.2 R79.2
N$100
  Top 0.305: R86.1 85.55,9.69 U8.P$1 84.81,9.01 84.81,11.28 83.55,12.54 R88.1
N$101
  Top 0.305: R87.2 77.12,8.98 U8.P$4 78.84,9.26 R89.2
N$103
  Top 0.406: IC10.12 IC10.13 92.95,55.72 R64.2 94.09,57.14 94.74,57.78 94.74,58.89 R41.2 C76.2
N$115  (via drill 0.6)
  Top 0.305: IC11.5 28.61,70.41 v28.09,69.9
  Bottom 0.305: v28.09,69.9 28.09,70.65 C89.2
N$128
  Top 0.305: C90.1 24.92,72.26 26.06,71.12 27.61,71.12 27.96,71.48 IC11.6
N$137
  Top 0.305: R66.2 R67.2 29.91,63.1 IC11.14
N$139  (via drill 0.6)
  Top 0.305: R69.2 R68.2 29.4,61.49 v28.88,61.49 | IC11.13 29.26,67.98 v29.08,68.15
  Bottom 0.305: v29.08,68.15 29.08,61.7 v28.88,61.49
N$147
  Top 0.305: IC11.2 30.56,73.62 C91.1
RX0  (via drill 0.6)
  Top 0.305: IC11.12 28.61,65.49 v28.22,64.69 | v28.12,58.17 v22.2,58.17 | v18.57,58.14 18.57,45.95 18.54,45.67 18.67,45.39 v18.8,45.39 | U1.27 33.71,43.98 33.27,44.42 27.3,44.42 26.67,45.06 26.67,45.14 v26.47,45.34
  Bottom 0.305: v28.22,64.69 28.25,65 27.91,65 27.91,58.37 v28.12,58.17 | v22.2,58.17 18.59,58.17 v18.57,58.14 | v26.47,45.34 18.85,45.34 v18.8,45.39
RX1  (via drill 0.6)
  Top 0.254: 7.54,67.79 7.56,67.79 U$1.P4
  Top 0.305: U1.5 32.14,54.98 v31.73,55.4 | v5.84,55.58 5.84,66.09 7.54,67.79
  Bottom 0.305: v31.73,55.4 6.02,55.4 v5.84,55.58
RX3  (via drill 0.6)
  Top 0.305: U1.18 32.87,48.49 32.66,48.28 32.66,47.12 v32.69,47.09 | U$3.P$2 9.03,30.37 3.17,36.22 3.17,46.18 v3.58,46.58
  Bottom 0.305: v32.69,47.09 8.53,47.09 8.2,46.76 3.76,46.76 v3.58,46.58
SCK  (via drill 0.6)
  Top 0.305: U1.110 54.38,71.5 v54.59,71.7 | v70.41,71.63 70.41,71.48
  Top 0.61: MICRO_SD.5 68.09,71.59 68.2,71.7 70.33,71.7 v70.41,71.63
  Bottom 0.305: v54.59,71.7 70.33,71.7 v70.41,71.63
SCL  (via drill 0.6)
  Top 0.305: U1.87 58.55,46.48 58.93,46.86 58.93,48.62 60.05,49.73 | 60.05,49.73 60.17,49.86 63.42,49.86 63.96,49.33 63.96,47.93 63.65,47.62 62.36,47.62 | R54.2 58.97,50.81 60.05,49.73 | 62.36,47.62 61.06,47.62 60.66,47.22 60.66,46.18 v60.58,46.1 | 62.36,47.62 U7.PIN6 | R87.1 76.37,11.61 v72.39,11.61 v68.86,11.61 | 72.24,23.93 v72.26,23.9 72.16,23.8 70.87,23.8 69.34,25.32 69.34,28.12 69.09,28.37 69.09,28.73 v69.06,28.75
  Bottom 0.305: v60.58,46.1 60.58,30.91 60.95,30.54 | R79.1 60.88,28.89 60.88,29.62 60.95,29.68 60.95,30.54 | 69.06,28.83 v69.06,28.75 69.09,30.2 67.77,31.52 61.92,31.52 60.95,30.54 | v72.26,23.9 72.26,11.73 v72.39,11.61 | R81.1 49.7,10.65 50.7,9.65 66.9,9.65 v68.86,11.61
  Bottom 0.406: R72.1 45.89,15.33 47.24,13.97 47.24,12.06 47.4,11.91 49.67,11.91 R81.1
SCL_2  (via drill 0.6)
  Top 0.305: U1.70 53.88,36.24 55.19,34.92 55.19,34.42 | R76.1 55.19,32.9 55.19,34.42 | 55.19,34.42 v55.22,34.44 | 78.83,14.43 R89.1 78.78,14.35 v74.4,14.35 v68.83,14.35 | v58.55,28.83 55.45,28.83 v55.17,28.55 55.17,28.57 55.47,28.88 59.56,28.88 61.67,30.99 66.88,30.99 67.87,30 69.62,30 69.95,29.67 70,29.67 70.03,29.64 70.03,25.58 70.54,25.07 73.2,25.07 v73.97,24.31
  Top 0.406: R75.1 49.29,15.81 v49.38,15.72
  Bottom 0.305: v55.22,34.44 55.22,28.6 v55.17,28.55 | v73.97,24.31 73.97,14.78 v74.4,14.35 | R83.1 49.7,14.95 50.14,15.39 55.96,15.39 57.07,14.28 68.76,14.28 v68.83,14.35
  Bottom 0.406: v49.38,15.72 49.38,14.47 R83.1
  Bottom 0.61: R85.1 58.58,28.86 v58.55,28.83
SDA  (via drill 0.6)
  Top 0.305: U1.86 58.79,45.98 | 58.79,45.98 59.44,46.63 59.44,48.39 60.02,48.97 61.06,48.97 U7.PIN5 | 58.79,45.98 59.53,45.24 R55.2 59.53,42.23 v59.54,42.22 | R86.2 86.22,11.59 v86.16,11.66 | v56.19,27.05 65.63,27.05 | 65.63,27.05 v65.76,27.18 | 65.63,27.05 65.71,27.05 66.65,26.11 66.65,19.36 | 66.65,19.36 66.65,8.51 66.85,8.31 73.86,8.31 v73.94,8.38 | v65.91,19.3 66.6,19.3 66.65,19.36
  Bottom 0.305: v86.16,11.66 86.16,11.53 82.83,8.2 74.12,8.2 v73.94,8.38 | v59.54,42.22 59.54,33.48 56.24,30.18 56.24,27.71 56.03,27.51 56.03,27.2 v56.19,27.05 | v65.76,27.18 65.76,27.77 R78.2 | R80.2 49.65,20.28 50.47,21.11 52.91,21.11 53.26,20.75 53.26,19.33 64.72,19.33 v65.91,19.3
  Bottom 0.406: R80.2 48.23,19.66 47.4,20.5 40.82,20.5 40.18,19.86 R71.2
SDA_2  (via drill 0.6)
  Top 0.305: U1.9 32.36,52.98 31.98,52.6 31.98,52.58 31.9,52.5 29.78,52.5 | 29.78,52.5 R77.1 | 29.78,52.5 29.78,52.46 29.18,51.87 v29.18,51.33 | v1.37,51.1 1.37,36.07 5.66,31.77 5.66,12.45 v13.06,5.05 | v68.99,16.59 80.42,16.59 81.38,15.62 81.38,14.46 R88.2
  Top 0.406: v45.41,19.36 44,19.36 R74.2 | v53.85,7.95 53.85,17.35 v53.75,17.45
  Bottom 0.254: 49.63,17.59 49.63,17.45 50.65,16.43 52.63,16.43
  Bottom 0.305: v1.37,51.1 1.6,51.33 10.08,51.33 11.35,52.6 27.91,52.6 v29.18,51.33 | R84.2 66.65,30.18 67.72,29.11 67.72,28.4 68.45,27.66 68.61,27.66 68.71,27.76 68.71,16.87 | 68.71,16.87 v68.99,16.59 | 68.71,16.87 53.75,16.87 53.06,16.87 52.63,16.43 | 49.63,17.59 R82.2
  Bottom 0.406: 49.63,17.59 47.18,17.59 v45.41,19.36 | v53.85,7.95 52.91,7.01 45.54,7.01 44.27,5.74 44.27,4.55 42.65,2.92 37.62,2.92 35.71,4.83 35.71,5.79 35,6.5 32.33,6.5 30.89,5.05 30.86,5.05 30.38,4.57 13.54,4.57 v13.06,5.05 | v53.75,17.45 53.75,16.87
TCK
  Top 0.305: U1.28 33.48,43.48 33.1,43.87 27.03,43.87 26.42,44.48 22.17,44.48 21.82,44.12 21.82,31.45 22.28,30.99 25.2,30.99 25.58,31.37 25.58,33.15 CON1.1
TDI
  Top 0.305: CON1.9 32.92,43.33 33.27,42.98 U1.29
TDO
  Top 0.305: U1.30 27.47,42.48 26.9,41.91 26.9,39.67 26.7,39.47 24.64,39.47 24.38,39.22 24.38,36.22 24.87,35.74 25.58,35.74 CON1.3
TMS
  Top 0.305: U1.31 29.51,41.98 27.58,40.06 27.58,38.66 27.23,38.3 25.65,38.3 CON1.5
TX0  (via drill 0.6)
  Top 0.305: IC11.11 27.96,65.98 v26.98,65 | v33.58,56.49 U1.2
  Bottom 0.305: v26.98,65 26.98,57.2 27.23,56.95 33.12,56.95 v33.58,56.49
TX1  (via drill 0.6)
  Top 0.254: 8.05,54.61 8.05,63.96 8.03,63.96 7.57,64.41 7.57,65.46 U$1.P3
  Top 0.305: 8.05,54.61 v8.18,54.48 | v29.74,54.48 U1.6
  Bottom 0.305: v8.18,54.48 v29.74,54.48
TX3  (via drill 0.6)
  Top 0.305: U$3.P$4 12.03,29.3 4.55,36.78 4.55,49.99 v4.83,50.27 | v32.41,49.94 33.36,48.98 U1.17
  Bottom 0.305: v4.83,50.27 14.05,50.27 14.48,49.84 32.31,49.84 v32.41,49.94
USB_D+
  Top 0.305: 25.98,8.02 X1.3
  Top 0.406: 25.98,8.02 25.98,9.86 27.25,11.12 28.36,11.12 R61.1
USB_D-
  Top 0.406: X1.2 25.16,10.77 R62.1
USB_GND
  Top 0.406: U2.2 24.36,18.11 24.54,18.29 31.62,18.29 31.98,17.93 | 31.98,17.93 U2.8 32,16.76 32,15.39 30.3,13.69 30.3,10.26 29.82,9.78 28.27,9.78 27.56,9.07 X1.5 | 31.98,17.93 31.98,18.54 32.44,19 35.27,19 C29.2
USB_VCC
  Top 0.406: X1.1 24.36,8.66 22.63,10.39 22.63,14.55 23.09,15.01 U2.1
VBG  (via drill 0.6)
  Top 0.305: v39.9,38.79 38.94,38.79 38.88,38.72 U1.40 38.88,36.49 38.56,36.17 38.28,36.17 v38.28,35.66
  Bottom 0.305: R4.2 33.1,35.05 33.81,34.34 33.81,33.53 34.39,32.94 36.52,32.94 36.52,34.8 37.62,34.77 v38.28,35.66 | v39.9,38.79 37.88,38.79 C27.1
VDDANA
  Top 0.305: U1.73 57.85,39.48 58.29,39.04 C11.1 | 61.98,37.06 60.41,37.06 C10.1
  Top 1.016: L1.2 62.74,36.3 61.98,37.06 58.3,37.06 C11.1
VDDOUT  (via drill 0.6)
  Top 0.305: U1.61 49.38,39.17 48.82,39.73 48.82,45.06 v48.79,45.09 | v46.05,45.19 46.05,39.42 46.86,38.61 46.86,37.45 U1.56 | U1.45 41.38,43.48 41.3,43.56 40.54,43.56 v39.19,44.91 | U1.10 36.9,52.48 36.91,52.48 | U1.104 54.91,54.98 v54.89,54.97 | U1.124 47.38,57.63 v48.23,56.77
  Top 0.61: 36.91,52.48 38,51.38 | 38,51.38 38,46.1 v39.19,44.91 40.49,46.2 45.8,46.2 | v46.05,45.19 46.05,45.95 45.8,46.2 | 45.8,46.2 47.68,46.2 | 47.68,46.2 v48.79,45.09 | 38,51.38 38.08,51.38 v38.23,51.54 | 47.68,46.2 48.26,46.2 v54.03,51.97
  Bottom 0.305: v48.79,45.09 48.79,46.02 C14.1 | C15.1 v46.05,45.19 | v39.19,44.91 39.19,46.06 C13.1 38.85,46.41 38,46.41 37.2,47.2 L4.1 | v54.89,54.97 54.01,54.97 C16.1 | v48.23,56.77 47.41,56.77 C18.1
  Bottom 0.61: v38.23,51.54 38.23,52.56 C17.1 | C12.1 52.95,45.65 52.58,46.02 48.88,46.02 C14.1 | v54.03,51.97 54.03,54.9 C16.1 53.98,56.07 53.31,56.74 48.26,56.74 v48.23,56.77
VDDOUTMI  (via drill 0.6)
  Top 0.305: U1.41 39.37,35.15 v38.46,34.24
  Top 0.61: C8.1 C9.1 45.76,25.26 45.74,25.25 44.86,25.25 v44.83,25.22
  Bottom 0.305: v38.46,34.24 39.75,34.24 40.41,33.58 40.41,32 40.87,31.55 41.94,31.55 42.44,31.04 42.44,29.9 42.42,29.9 40.89,28.37 40.89,27.33 40.92,26.31 L2.2
  Bottom 0.61: v44.83,25.22 41.64,25.22 L2.2
VDDPLL  (via drill 0.6)
  Top 0.305: 32.66,37.69 32.66,40.13 33.02,40.48 U1.34 37.06,40.49 37.36,40.79 37.36,42.04 37.62,42.29 38.25,42.29 38.48,42.52 38.48,43.79 v37.54,44.73 | 32.66,37.69 32.66,33.54 C22.1 | C21.1 32.65,37.71 32.66,37.69
  Bottom 0.305: L4.2 37.27,45 v37.54,44.73
VIN(+12V)
  Top 1.676: J1.2 90.17,23.39 91.11,22.45 96.06,22.45 97.61,20.9 97.61,12.25 D9.A
WIFI
  Top 0.254: 9.07,70.97 U$1.P10
  Top 0.305: WIFI.C 9.43,71.33 9.07,70.97
XIN  (via drill 0.6)
  Top 0.305: U1.36 35.1,39.26 C24.1 34.4,36.52 v34.19,36.52
  Bottom 0.305: Y1.1 30.44,36.81 30.81,36.45 34.11,36.45 v34.19,36.52
XIN32  (via drill 0.6)
  Top 0.305: U1.48 42.88,38.53 43,38.66 43,42.85 v41.27,44.58
  Bottom 0.305: C26.1 v41.27,44.58 39.57,42.88 Y2.P$2
XOUT  (via drill 0.6)
  Top 0.305: U1.35 34.3,39.98 v33.81,39.5
  Bottom 0.305: v33.81,39.5 32.81,39.5 Y1.3 32.28,40.02 32.28,40.82 31.85,41.25 29.39,41.25 28.47,40.34 C23.1
XOUT32  (via drill 0.6)
  Top 0.305: U1.49 43.38,38.3 43.56,38.48 43.56,44.88 v43.38,45.06
  Bottom 0.305: C25.1 43.38,46.06 v43.38,45.06 42.67,44.35 Y2.P$1

## Text on the board
tPlace: Sensirion Control Board Rev 1.0 | The Measurement Standards Laboratory of New Zealand | Designed by Chris Young
tNames: * | U7 | *